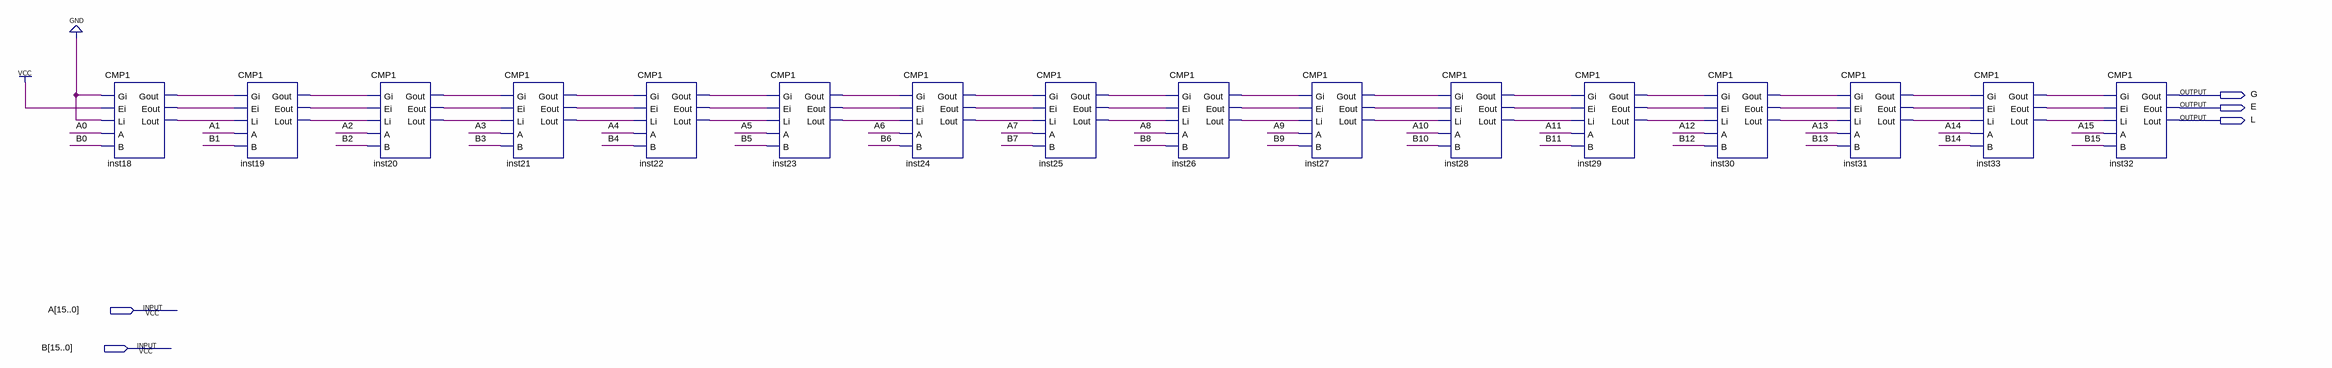
[diagram p0: schematic sheet]
// Quartus schematic CMP16.bdf as structural Verilog: 16 symbols, 5 pins
module CMP16 (
  input  [15:0] A,
  input  [15:0] B,
  output G,
  output E,
  output L
);

  wire inst18_eout, inst18_gout, inst18_lout, inst19_eout, inst19_gout, inst19_lout, inst20_eout,
       inst20_gout, inst20_lout, inst21_eout, inst21_gout, inst21_lout, inst22_eout, inst22_gout,
       inst22_lout, inst23_eout, inst23_gout, inst23_lout, inst24_eout, inst24_gout, inst24_lout,
       inst25_eout, inst25_gout, inst25_lout, inst26_eout, inst26_gout, inst26_lout, inst27_eout,
       inst27_gout, inst27_lout, inst28_eout, inst28_gout, inst28_lout, inst29_eout, inst29_gout,
       inst29_lout, inst30_eout, inst30_gout, inst30_lout, inst31_eout, inst31_gout, inst31_lout,
       inst33_eout, inst33_gout, inst33_lout;

  CMP1 inst18 (
    .Gi(1'b0), .Ei(1'b1), .Li(1'b0), .A(A[0]), .B(B[0]), .Gout(inst18_gout), .Eout(inst18_eout),
    .Lout(inst18_lout));
  CMP1 inst19 (
    .Gi(inst18_gout), .Ei(inst18_eout), .Li(inst18_lout), .A(A[1]), .B(B[1]), .Gout(inst19_gout),
    .Eout(inst19_eout), .Lout(inst19_lout));
  CMP1 inst20 (
    .Gi(inst19_gout), .Ei(inst19_eout), .Li(inst19_lout), .A(A[2]), .B(B[2]), .Gout(inst20_gout),
    .Eout(inst20_eout), .Lout(inst20_lout));
  CMP1 inst21 (
    .Gi(inst20_gout), .Ei(inst20_eout), .Li(inst20_lout), .A(A[3]), .B(B[3]), .Gout(inst21_gout),
    .Eout(inst21_eout), .Lout(inst21_lout));
  CMP1 inst22 (
    .Gi(inst21_gout), .Ei(inst21_eout), .Li(inst21_lout), .A(A[4]), .B(B[4]), .Gout(inst22_gout),
    .Eout(inst22_eout), .Lout(inst22_lout));
  CMP1 inst23 (
    .Gi(inst22_gout), .Ei(inst22_eout), .Li(inst22_lout), .A(A[5]), .B(B[5]), .Gout(inst23_gout),
    .Eout(inst23_eout), .Lout(inst23_lout));
  CMP1 inst24 (
    .Gi(inst23_gout), .Ei(inst23_eout), .Li(inst23_lout), .A(A[6]), .B(B[6]), .Gout(inst24_gout),
    .Eout(inst24_eout), .Lout(inst24_lout));
  CMP1 inst25 (
    .Gi(inst24_gout), .Ei(inst24_eout), .Li(inst24_lout), .A(A[7]), .B(B[7]), .Gout(inst25_gout),
    .Eout(inst25_eout), .Lout(inst25_lout));
  CMP1 inst26 (
    .Gi(inst25_gout), .Ei(inst25_eout), .Li(inst25_lout), .A(A[8]), .B(B[8]), .Gout(inst26_gout),
    .Eout(inst26_eout), .Lout(inst26_lout));
  CMP1 inst27 (
    .Gi(inst26_gout), .Ei(inst26_eout), .Li(inst26_lout), .A(A[9]), .B(B[9]), .Gout(inst27_gout),
    .Eout(inst27_eout), .Lout(inst27_lout));
  CMP1 inst28 (
    .Gi(inst27_gout), .Ei(inst27_eout), .Li(inst27_lout), .A(A[10]), .B(B[10]), .Gout(inst28_gout),
    .Eout(inst28_eout), .Lout(inst28_lout));
  CMP1 inst29 (
    .Gi(inst28_gout), .Ei(inst28_eout), .Li(inst28_lout), .A(A[11]), .B(B[11]), .Gout(inst29_gout),
    .Eout(inst29_eout), .Lout(inst29_lout));
  CMP1 inst30 (
    .Gi(inst29_gout), .Ei(inst29_eout), .Li(inst29_lout), .A(A[12]), .B(B[12]), .Gout(inst30_gout),
    .Eout(inst30_eout), .Lout(inst30_lout));
  CMP1 inst31 (
    .Gi(inst30_gout), .Ei(inst30_eout), .Li(inst30_lout), .A(A[13]), .B(B[13]), .Gout(inst31_gout),
    .Eout(inst31_eout), .Lout(inst31_lout));
  CMP1 inst33 (
    .Gi(inst31_gout), .Ei(inst31_eout), .Li(inst31_lout), .A(A[14]), .B(B[14]), .Gout(inst33_gout),
    .Eout(inst33_eout), .Lout(inst33_lout));
  CMP1 inst32 (
    .Gi(inst33_gout), .Ei(inst33_eout), .Li(inst33_lout), .A(A[15]), .B(B[15]), .Gout(G), .Eout(E), .Lout(L));
endmodule
